# EAGLE schematic pilot (EAGLE 9.6.2)
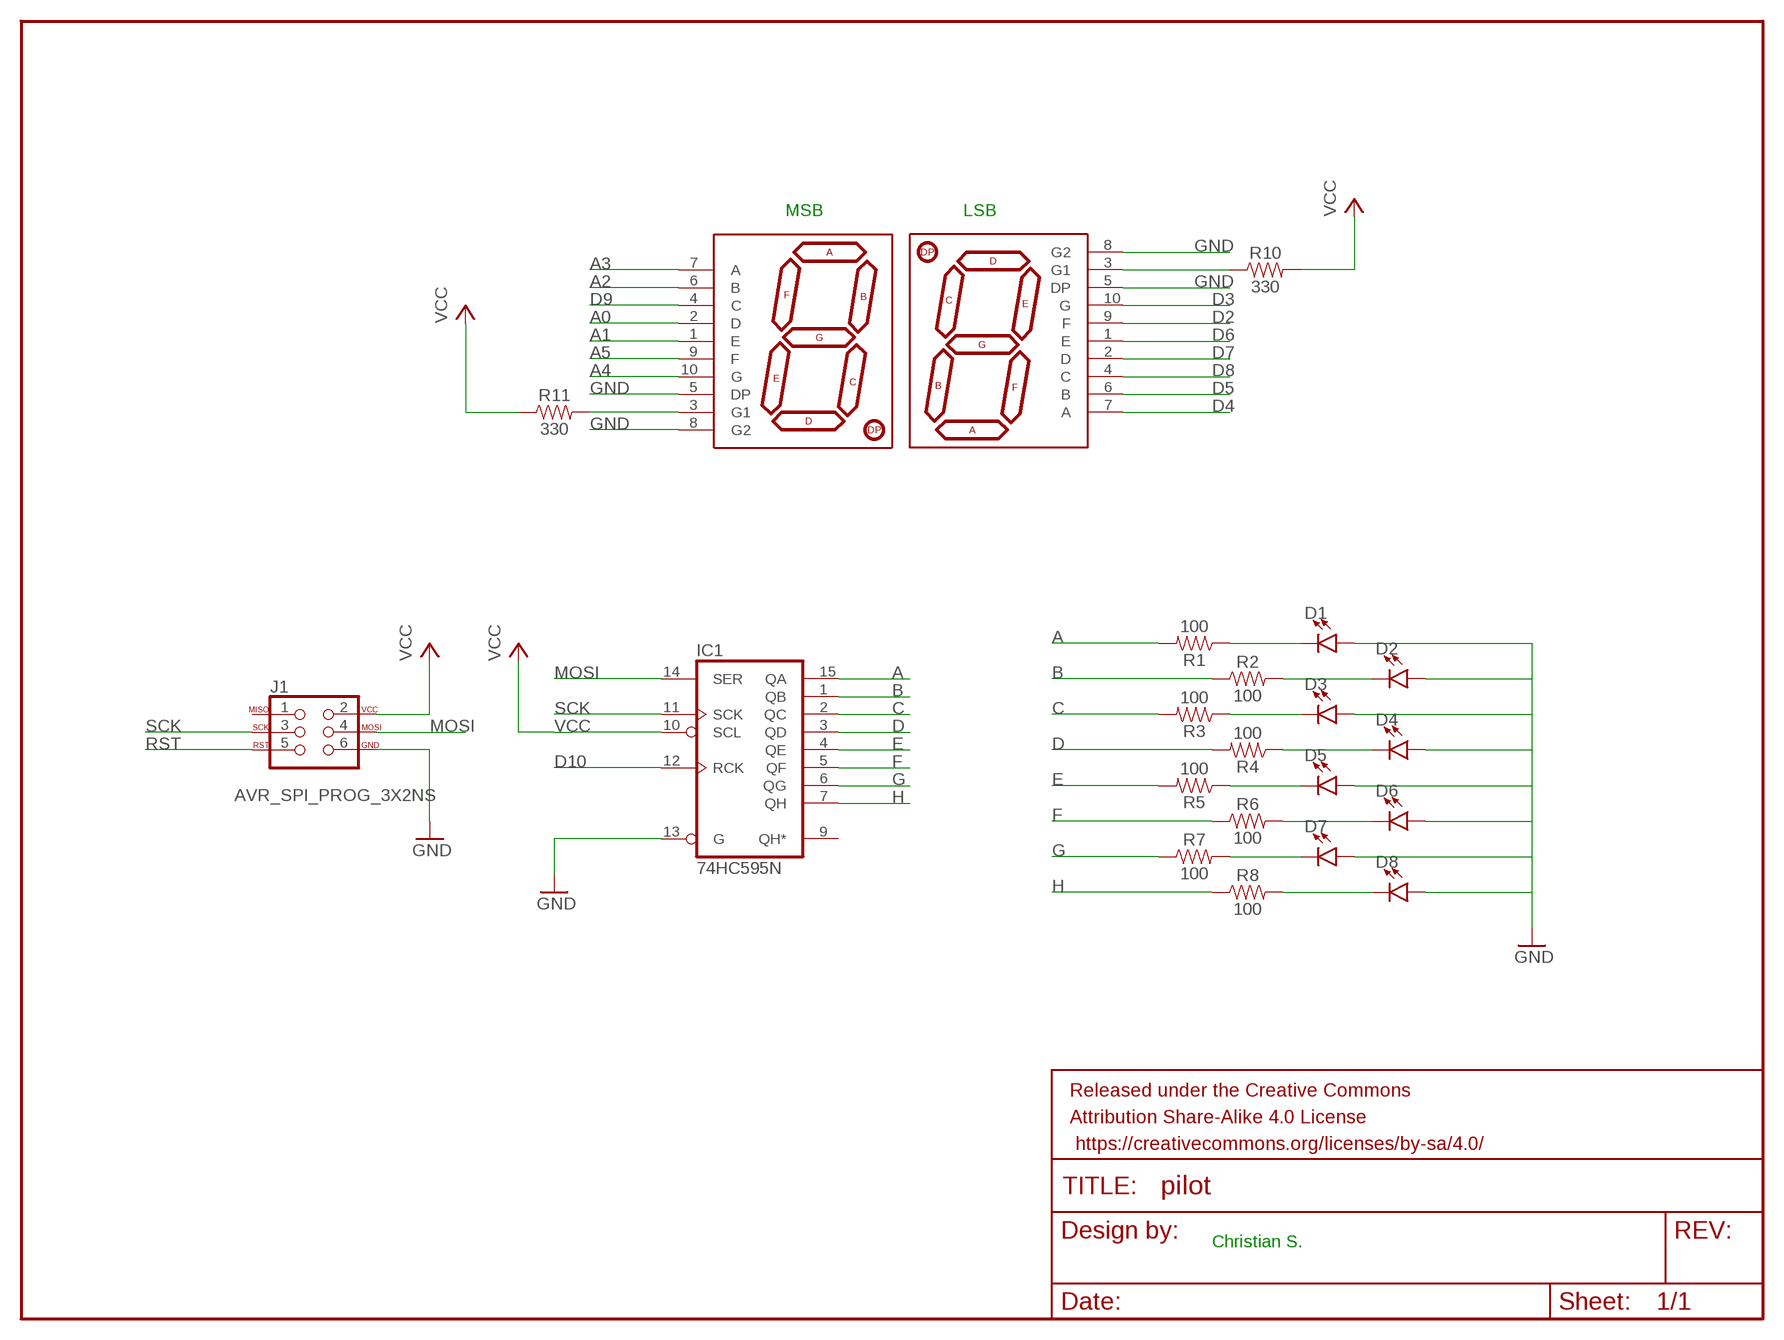
[diagram p0: schematic, sheet 1]

## Parts
D1  LED3MM  [LED_3MM]
D2  LED3MM  [LED_3MM]
D3  LED3MM  [LED_3MM]
D4  LED3MM  [LED_3MM]
D5  LED3MM  [LED_3MM]
D6  LED3MM  [LED_3MM]
D7  LED3MM  [LED_3MM]
D8  LED3MM  [LED_3MM]
FRAME1  FRAME-LETTER  [CREATIVE_COMMONS]
IC1  74HC595N  [DIL16]
J1  AVR_SPI_PROG_3X2NS  [2X3-NS]
R1  100  10OHM-0603-1/10W-1%  [0603]
R2  100  10OHM-0603-1/10W-1%  [0603]
R3  100  10OHM-0603-1/10W-1%  [0603]
R4  100  10OHM-0603-1/10W-1%  [0603]
R5  100  10OHM-0603-1/10W-1%  [0603]
R6  100  10OHM-0603-1/10W-1%  [0603]
R7  100  10OHM-0603-1/10W-1%  [0603]
R8  100  10OHM-0603-1/10W-1%  [0603]
R10  330  330OHM-0603-1/10W-1%  [0603]
R11  330  330OHM-0603-1/10W-1%  [0603]
U$1  YSD-160AB3C-8  7-SEGMENT-1DIGIT-1INCH-BLUE  [7-SEGMENT-1"PTH]
U$2  YSD-160AB3C-8  7-SEGMENT-1DIGIT-1INCH-BLUE  [7-SEGMENT-1"PTH]

## Nets
A: IC1.15(QA) R1.2
A0: U$1.2(D)
A1: U$1.1(E)
A2: U$1.6(B)
A3: U$1.7(A)
A4: U$1.10(G)
A5: U$1.9(F)
B: IC1.1(QB) R2.1
C: IC1.2(QC) R3.2
D: IC1.3(QD) R4.2
D2: U$2.9(F)
D3: U$2.10(G)
D4: U$2.7(A)
D5: U$2.6(B)
D6: U$2.1(E)
D7: U$2.2(D)
D8: U$2.4(C)
D9: U$1.4(C)
D10: IC1.12(RCK)
E: IC1.4(QE) R5.2
F: IC1.5(QF) R6.1
G: IC1.6(QG) R7.1
GND: D1.A D2.A D3.A D4.A D5.A D6.A D7.A D8.A IC1.13(G) J1.6 U$1.5(DP) U$1.8(G2) U$2.5(DP) U$2.8(G2)
H: IC1.7(QH) R8.1
MOSI: IC1.14(SER) J1.4
N$1: D1.K(C) R1.1
N$2: D2.K(C) R2.2
N$3: D3.K(C) R3.1
N$4: D4.K(C) R4.1
N$5: D5.K(C) R5.1
N$6: D6.K(C) R6.2
N$7: D7.K(C) R7.2
N$8: D8.K(C) R8.2
N$17: R11.2 U$1.3(G1)
N$20: R10.1 U$2.3(G1)
RST: J1.5
SCK: IC1.11(SCK) J1.3
VCC: IC1.10(SCL) J1.2 R10.2 R11.1
Unconnected: IC1.9(QH*) J1.1

## Notes on the sheet
- MSB | LSB
- Christian S.

## Power pins joined to a net without a drawn wire
GND: IC1.8(GND)
VCC: IC1.16(VCC)

## Library data of the parts
D1-D8 = SparkFun-LED:LED: LED (Generic) Standard schematic elements and footprints for 5mm, 3mm, 1206, and 0603 sized LEDs. Generic LEDs with no color specified.; PROD_ID: DIO-08794
FRAME1 = SparkFun-Aesthetics:FRAME-LETTER: Schematic Frame - Letter Standard 8.5x11 US Letter frame
IC1 = 74xx-eu:74*595: 8-bit SHIFT REGISTER, output latch
J1 = SparkFun-Connectors:AVR_SPI_PROG_3X2: AVR ISP 6 Pin This is the reduced ISP connector for AVR programming. Common on Arduino. This footprint will take up less PCB space and can be used with a 10-pin to 6-pin adapter such as SKU: BOB-08508 **Special note about "TEST_POINT" package. The stop mask is on the top side, so if you want your programming test points to be on the bottom of your board, make sure to place this package on the bottom side of the board. This also ensure that the orientation to program from the bottom side will be correct. SparkFun Products: SparkFun ISP Pogo Adapter <https://www.sparkfun.com/products/11591> - NS Tiny AVR Programmer <https://www.sparkfun.com/products/11801> -PTH
R1-R8 = SparkFun-Resistors:10OHM: 10Ω resistor A resistor is a passive two-terminal electrical component that implements electrical resistance as a circuit element. Resistors act to reduce current flow, and, at the same time, act to lower voltage levels within circuits. - Wikipedia; PROD_ID: RES-12581; VALUE: 10
R10 R11 = SparkFun-Resistors:330OHM: 330Ω resistor A resistor is a passive two-terminal electrical component that implements electrical resistance as a circuit element. Resistors act to reduce current flow, and, at the same time, act to lower voltage levels within circuits. - Wikipedia; PROD_ID: RES-00818
U$1 U$2 = SparkFun-LED:7-SEGMENT-1DIGIT-1INCH: 7-Segment Display, single digit, 1" EZ is for kits. Pads are only exposed on the bottom side to help prevent soldering in upside down. Datasheet (Red) <https://cdn.sparkfun.com/datasheets/Components/LED/YSD-160AR4B-8.pdf> Datasheet (Blue) <https://cdn.sparkfun.com/datasheets/Components/LED/YSD-160AB3C-8.pdf> SparkFun Products 7-Segment Display - LED (Red) <https://www.sparkfun.com/products/8546> (COM-08546) 7-Segment Display - LED (Blue) <https://www.sparkfun.com/products/9191> (COM-09191); PROD_ID: COMP-09495